# Altium project ATMega64_Breakout.PrjPcb
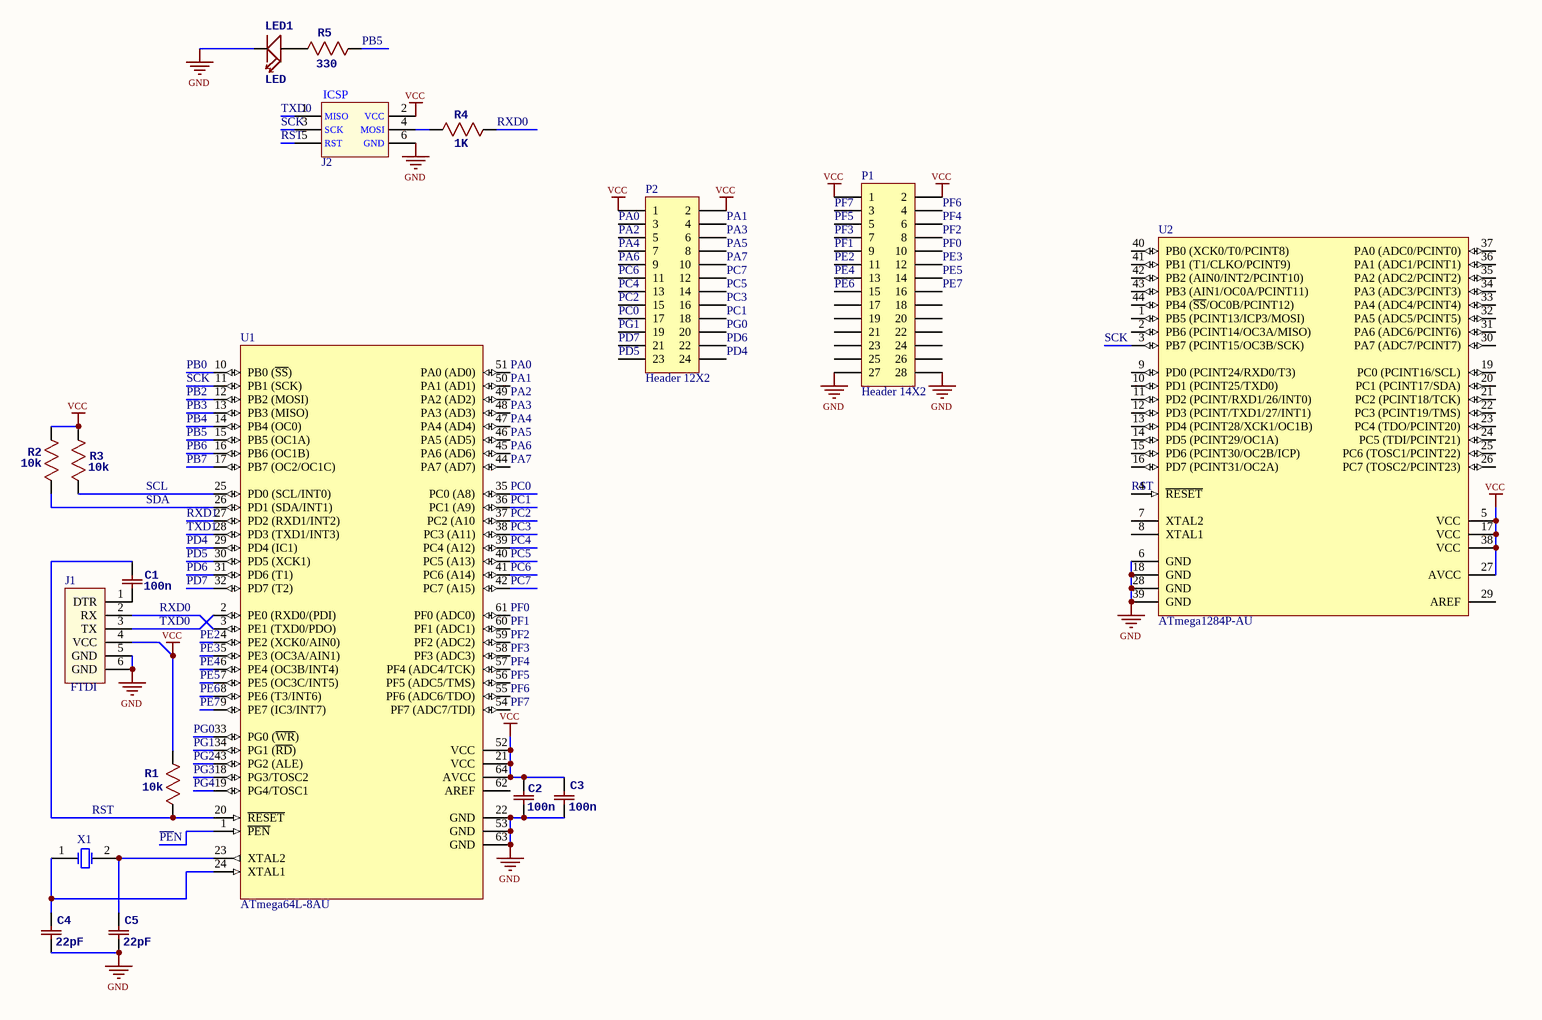
[diagram p0: ATMega64_Breakout.SchDoc]
TItle: ATMega64_Breakout
1 sheet, 18 parts. Net scope: global (net labels, ports and power ports of the same name join across sheets).
Board file: ATMega64_Breakout.PcbDoc

## Sheet ATMega64_Breakout.SchDoc: ATMega64_Breakout
size B; ApprovedBy: DMH; CheckedBy: DMH; Author: DMH; DrawnBy: DMH; Engineer: DMH; Revision: A0; SheetNumber: 1; SheetTotal: 1

### Parts
C1  100n  [CAPC0805(2012)75_N]
C2  100n  [CAPC0805(2012)75_N]
C3  100n  [CAPC0805(2012)75_N]
C4  22pF  [CAPC0805(2012)75_N]
C5  22pF  [CAPC0805(2012)75_N]
J1  FTDI  [HDR1X6]
J2  ICSP  [ICSP]
LED1  LED  [LED-0805]
P1  Header 14X2  [HDR2X14]
P2  Header 12X2  [HDR2X12]
R1  10k  [RCHIP0805]
R2  10k  [RCHIP0805]
R3  10k  [RCHIP0805]
R4  1K  [RCHIP0805]
R5  330  [RCHIP0805]
U1  ATmega64L-8AU  [64A_M]
U2  ATmega1284P-AU  [44A_L]
X1  XTAL  [CRES_SMT]  (value not drawn)

### Nets
GND: C2.1(C1) C3.1(C1) C4.1(C1) C5.1(C1) J1.5(GND) J1.6(GND) J2.6(GND) LED1.- P1.27 P1.28 U1.22(GND) U1.53(GND) U1.63(GND) U2.6(GND) U2.18(GND) U2.28(GND) U2.39(GND)
VCC: C2.2(C2) C3.2(C2) J1.4(VCC) J2.2(VCC) P1.1 P1.2 P2.1 P2.2 R1.1(R1) R2.1(R1) R3.1(R1) U1.21(VCC) U1.52(VCC) U1.64(AVCC) U2.5(VCC) U2.17(VCC) U2.27(AVCC) U2.38(VCC)
~{PE}N: U1.1(~{PEN})
PA0: P2.3 U1.51(PA0_(AD0))
PA1: P2.4 U1.50(PA1_(AD1))
PA2: P2.5 U1.49(PA2_(AD2))
PA3: P2.6 U1.48(PA3_(AD3))
PA4: P2.7 U1.47(PA4_(AD4))
PA5: P2.8 U1.46(PA5_(AD5))
PA6: P2.9 U1.45(PA6_(AD6))
PA7: P2.10 U1.44(PA7_(AD7))
PB0: U1.10(PB0_(~{SS}))
PB2: U1.12(PB2_(MOSI))
PB3: U1.13(PB3_(MISO))
PB4: U1.14(PB4_(OC0))
PB5: R5.2(R2) U1.15(PB5_(OC1A))
PB6: U1.16(PB6_(OC1B))
PB7: U1.17(PB7_(OC2/OC1C))
PC0: P2.17 U1.35(PC0_(A8))
PC1: P2.18 U1.36(PC1_(A9))
PC2: P2.15 U1.37(PC2_(A10)
PC3: P2.16 U1.38(PC3_(A11))
PC4: P2.13 U1.39(PC4_(A12))
PC5: P2.14 U1.40(PC5_(A13))
PC6: P2.11 U1.41(PC6_(A14))
PC7: P2.12 U1.42(PC7_(A15))
PD4: P2.24 U1.29(PD4_(IC1))
PD5: P2.23 U1.30(PD5_(XCK1))
PD6: P2.22 U1.31(PD6_(T1))
PD7: P2.21 U1.32(PD7_(T2))
PE2: P1.11 U1.4(PE2_(XCK0/AIN0))
PE3: P1.12 U1.5(PE3_(OC3A/AIN1))
PE4: P1.13 U1.6(PE4_(OC3B/INT4))
PE5: P1.14 U1.7(PE5_(OC3C/INT5))
PE6: P1.15 U1.8(PE6_(T3/INT6))
PE7: P1.16 U1.9(PE7_(IC3/INT7))
PF0: P1.10 U1.61(PF0_(ADC0))
PF1: P1.9 U1.60(PF1_(ADC1))
PF2: P1.8 U1.59(PF2_(ADC2))
PF3: P1.7 U1.58(PF3_(ADC3))
PF4: P1.6 U1.57(PF4_(ADC4/TCK))
PF5: P1.5 U1.56(PF5_(ADC5/TMS))
PF6: P1.4 U1.55(PF6_(ADC6/TDO))
PF7: P1.3 U1.54(PF7_(ADC7/TDI))
PG0: P2.20 U1.33(PG0_(~{WR}))
PG1: P2.19 U1.34(PG1_(~{RD}))
PG2: U1.43(PG2_(ALE))
PG3: U1.18(PG3/TOSC2)
PG4: U1.19(PG4/TOSC1)
RST: C1.2(C2) J2.5(RST) R1.2(R2) U1.20(~{RESET}) U2.4(~{RESET})
RXD0: J1.2(RX) R4.1(R1) U1.3(PE1_(TXD0/PDO))
RXD1: U1.27(PD2_(RXD1/INT2))
SCK: J2.3(SCK) U1.11(PB1_(SCK)) U2.3(PB7_(PCINT15/OC3B/SCK))
SCL: R3.2(R2) U1.25(PD0_(SCL/INT0))
SDA: R2.2(R2) U1.26(PD1_(SDA/INT1))
TXD0: J1.3(TX) J2.1(MISO) U1.2(PE0_(RXD0/(PDI))
TXD1: U1.28(PD3_(TXD1/INT3))
NetC1_1: C1.1(C1) J1.1(DTR)
NetC4_2: C4.2(C2) U1.24(XTAL1) X1.1(OSC1)
NetC5_2: C5.2(C2) U1.23(XTAL2) X1.2(OSC2)
NetJ2_4: J2.4(MOSI) R4.2(R2)
NetLED1_+: LED1.+ R5.1(R1)

Not connected (* = marked no-connect by the designer): P1 17 18 19 20 21 22 23 24 25 26; U1 62(AREF); U2 1(PB5_(PCINT13/ICP3/MOSI)) 2(PB6_(PCINT14/OC3A/MISO)) 7(XTAL2) 8(XTAL1) 9(PD0_(PCINT24/RXD0/T3)) 10(PD1_(PCINT25/TXD0)) 11(PD2_(PCINT/RXD1/26/INT0)) 12(PD3_(PCINT/TXD1/27/INT1)) 13(PD4_(PCINT28/XCK1/OC1B)) 14(PD5_(PCINT29/OC1A)) 15(PD6_(PCINT30/OC2B/ICP)) 16(PD7_(PCINT31/OC2A)) 19(PC0_(PCINT16/SCL)) 20(PC1_(PCINT17/SDA)) 21(PC2_(PCINT18/TCK)) 22(PC3_(PCINT19/TMS)) 23(PC4_(TDO/PCINT20)) 24(PC5_(TDI/PCINT21)) 25(PC6_(TOSC1/PCINT22)) 26(PC7_(TOSC2/PCINT23)) 29(AREF) 30(PA7_(ADC7/PCINT7)) 31(PA6_(ADC6/PCINT6)) 32(PA5_(ADC5/PCINT5)) 33(PA4_(ADC4/PCINT4)) 34(PA3_(ADC3/PCINT3)) 35(PA2_(ADC2/PCINT2)) 36(PA1_(ADC1/PCINT1)) 37(PA0_(ADC0/PCINT0)) 40(PB0_(XCK0/T0/PCINT8)) 41(PB1_(T1/CLKO/PCINT9)) 42(PB2_(AIN0/INT2/PCINT10)) 43(PB3_(AIN1/OC0A/PCINT11)) 44(PB4_(~{SS}/OC0B/PCINT12))

### Notes on the sheet
- Title
- Size:
- Date:
- B
- Number:
- Time:
- Revision:
- Sheet
- of
- File:

### Library data of the parts
C1-C5 = U0805F104ZCT: TOLERANCE: -20/+80%; VOLTAGERATING: 50V; MPN: U0805F104ZCT; OC_FARNELL: 9406409; OC_NEWARK: 38K9281; SUPPLIER: Multicomp
J1 = ICSP: In-Circuit Serial Programming Header
J2 = ICSP: AVR ICSP
LED1 = SMD-LED-CLEAR-RED(0805): MPN: 17-215SURC/S530-A2/TR8
P1 = Header 14X2: Header, 14-Pin, Dual row; LatestRevisionDate: 17-Jul-2002; LatestRevisionNote: Re-released for DXP Platform.; Publisher: Altium Limited
P2 = Header 12X2: Header, 12-Pin, Dual row; LatestRevisionDate: 17-Jul-2002; LatestRevisionNote: Re-released for DXP Platform.; Publisher: Altium Limited
R1-R3 = MC0.1W08051%10K: TOLERANCE: ±1%; WATTAGE: 1/10 W; MPN: MC0.1W08051%10K; OC_FARNELL: 9332391; OC_NEWARK: -; SUPPLIER: Multicomp
R4 R5 = MC0.1W08051%1K: TOLERANCE: ±1%; WATTAGE: 1/10 W; MPN: MC0.1W08051%1K; OC_FARNELL: 9332383; OC_NEWARK: -; SUPPLIER: Multicomp
U1 = ATmega64L-8AU: 8-bit AVR Microcontroller, 2.7-5.5V, 64KB Flash, 2KB EEPROM, 4KB SRAM, 64-pin TQFP, Industrial Grade (-40°C to 85°C), Pb-Free; DatasheetVersion: revQ, Jul-2010; PackageVersion: revC, Oct-2010; PackageReference: 64A; PackageDescription: 64-Pin Plastic Thin Profile Quad Flat Pack, 14 x 14 x 1.0 mm Body, 0.8 mm Pitch (TQFP); Code_JEDEC: MS-026-AEB; ComponentLink1Description: Manufacturer URL; ComponentLink1URL: http://www.atmel.com/; ComponentLink2Description: ATmega64(L)  Datasheet; ComponentLink2URL: http://www.atmel.com/dyn/resources/prod_documents/doc2490.pdf; ComponentLink3Description: ATmega64(L) Summary; ComponentLink3URL: http://www.atmel.com/dyn/resources/prod_documents/2490S.pdf
U2 = ATmega1284P-AU: 8-bit AVR Microcontroller, 128KB Flash, 4KB EEPROM, 16KB SRAM, 44-pin TQFP, Industrial Grade (-40°C to 85°C); DatasheetVersion: revC, Jun-2011; PackageVersion: revC, Oct-2010; PackageReference: 44A; PackageDescription: 44-Pin Plastic Thin Profile Quad Flat Pack, 10 x 10 x 1.0 mm Body, 0.8 mm Pitch (TQFP); Code_JEDEC: MS-026-ACB; ComponentLink1Description: Manufacturer URL; ComponentLink1URL: http://www.atmel.com/; ComponentLink2Description: ATmega164A/164PA/324A/324PA/644A/644PA/1284/1284P Datasheet; ComponentLink2URL: http://www.atmel.com/dyn/resources/prod_documents/doc8272.pdf; ComponentLink3Description: ATmega164A/164PA/324A/324PA/644A/644PA/1284/1284P Summary; ComponentLink3URL: http://www.atmel.com/dyn/resources/prod_documents/8272S.pdf
X1 = XTAL: Crystal Oscillator; pin to pad: 2>3; Published: 8-Jun-2000; LatestRevisionDate: 17-Jul-2002; LatestRevisionNote: Re-released for DXP Platform.; PackageReference: R38; Publisher: Altium Limited; PackageDescription: Crystal, Thru-Hole; 2 Leads; Body 3.1 x 8.2 mm (Dia.xH)